# EasyEDA Pro project ProPrj_LED驱动_2025-10-14.epro

# Board PCB1
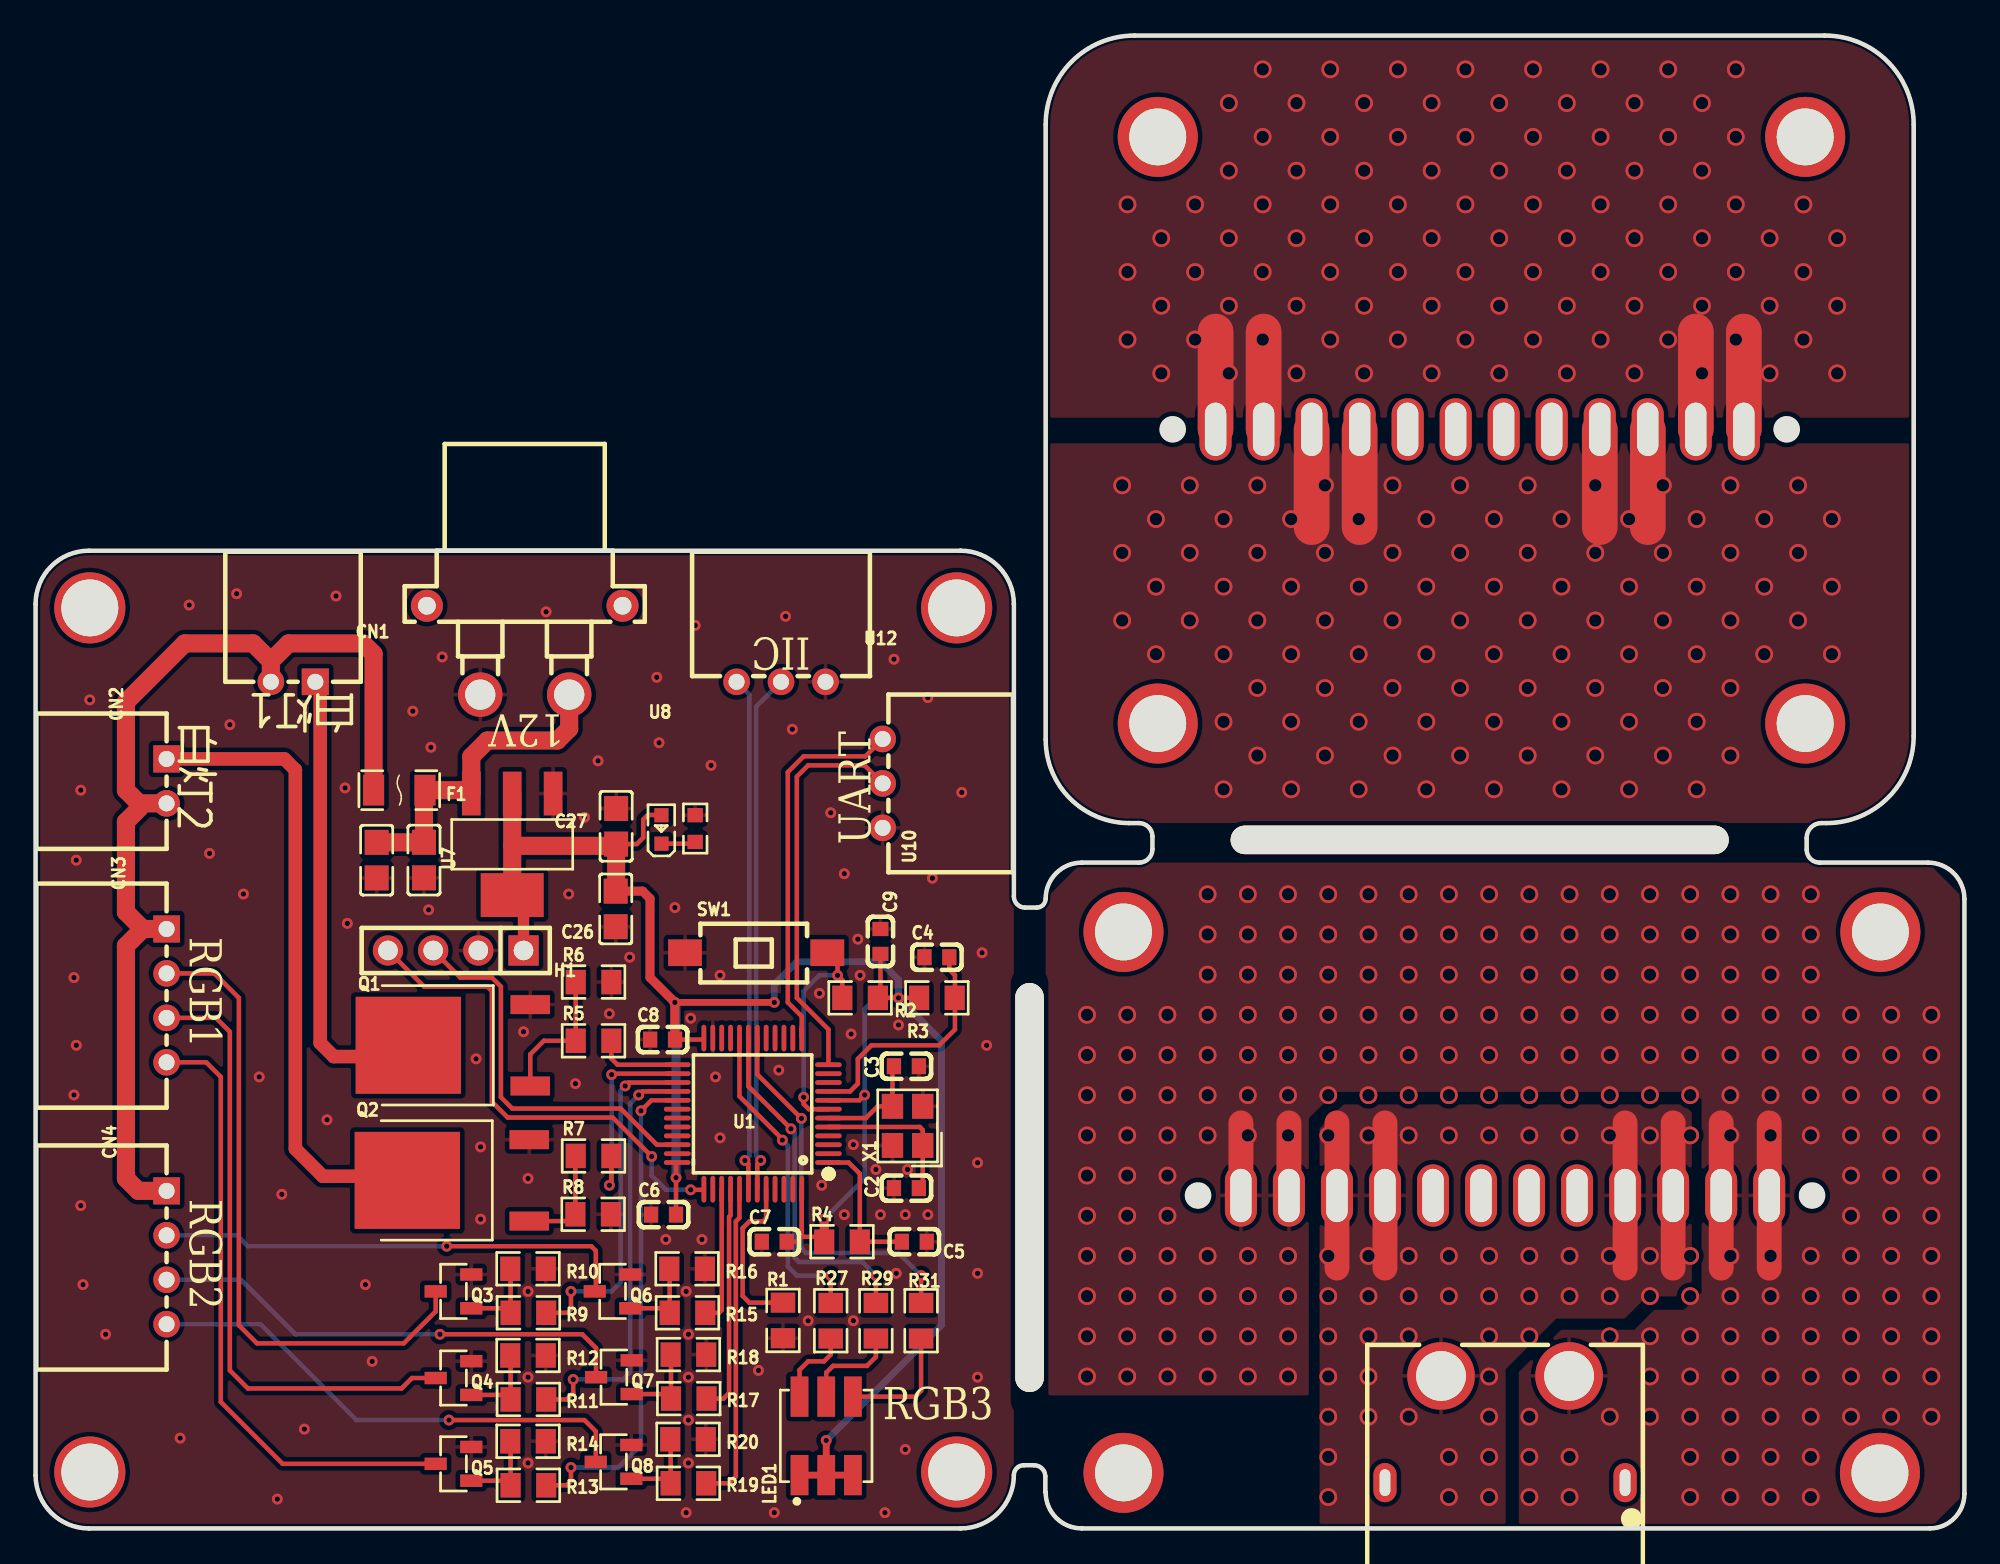
[diagram p0: board, top side]
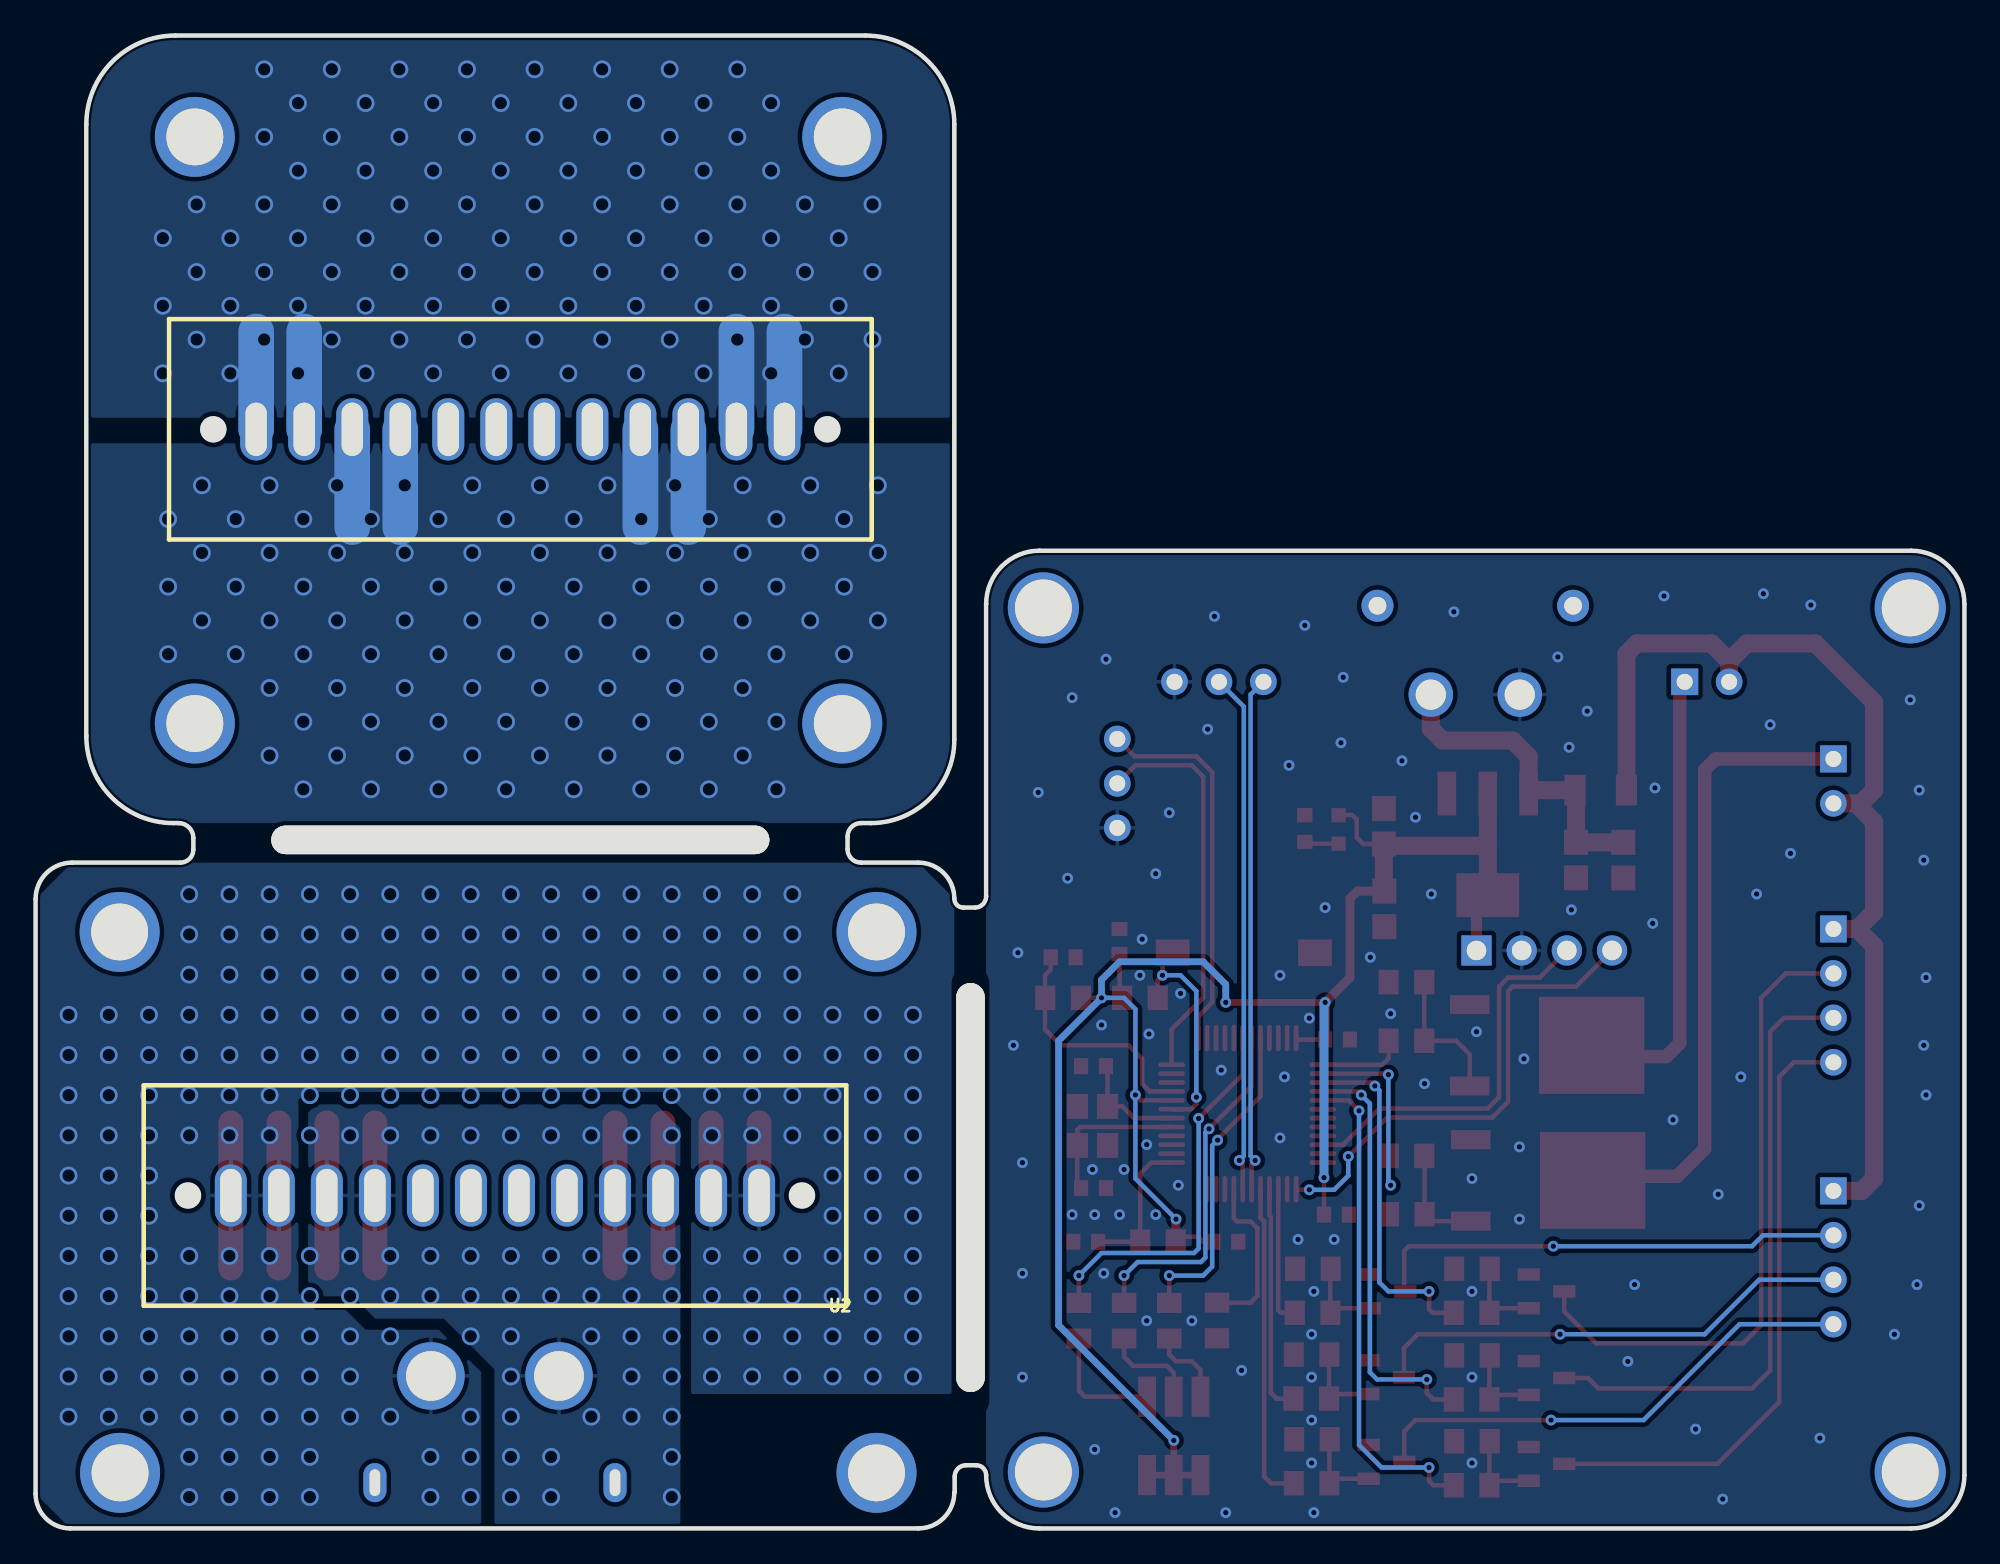
[diagram p1: board, bottom side, seen from below]

Outline 108.44 x 83.98 mm; copper layers: Top Layer, Bottom Layer. Coordinates in mm from the lower left corner of the outline.
Outline path: 0,52 arc(0.88,54.12) 3,55 52,55 arc(54.12,54.12) 55,52 55,35.55 arc(55.18,35.11) 55.63,34.92 56.28,34.92 arc(56.64,35.07) 56.79,35.43 arc(57.38,36.86) 58.81,37.45 62.04,37.45 arc(62.57,37.68) 62.79,38.21 62.79,38.92 arc(62.57,39.46) 62.03,39.68 61.49,39.68 arc(58.17,41.05) 56.79,44.38 56.79,78.98 arc(58.25,82.51) 61.79,83.98 100.59,83.98 arc(104.12,82.51) 105.59,78.98 105.59,44.58 arc(104.15,41.11) 100.69,39.68 100.41,39.68 arc(99.82,39.43) 99.57,38.84 99.57,38.18 arc(99.78,37.67) 100.3,37.45 106.39,37.45 arc(107.84,36.85) 108.44,35.4 108.44,1.95 arc(107.87,0.57) 106.49,0 58.81,0 arc(57.38,0.6) 56.79,2.03 arc(56.77,2.03) 56.77,2.05 56.77,2.92 arc(56.58,3.37) 56.13,3.56 55.56,3.56 arc(55.16,3.39) 55,3 arc(54.12,0.88) 52,0 3,0 arc(0.88,0.88) 0,3 0,52
Stack: Top Layer 0.035mm / Dielectric1 1.51mm FR4 er 4.5 / Bottom Layer 0.035mm

## Design rules (mm)
template: JLCPCB Capability(Two Layers Board)
spacing copperThickness1oz (default): track to track 0.102, other pairs 0.152 to 0.3
spacing copperThickness2oz: track to track 0.203, other pairs 0.152 to 0.3
track width copperThickness1oz (default): min 0.127, default 0.254, max 2.54
track width copperThickness2oz: min 0.203, default 0.254, max 2.54
differential pair differentialPair (default): width min 0.127, default 0.254, max 2.54; gap min 0.152, default 0.152
via viaSize (default): diameter min 0.5, default 0.61, max 10; hole min 0.3, default 0.305, max 6.3

## Placement (name value [footprint] x y rotation side)
C2  12pF  [C0603]  48.96 19.14 180 top
C3  12pF  [C0603]  48.96 26 180 top
C4  100nF  [C0603]  50.67 32.13 0 top
C5  100nF  [C0603]  49.4 16.13 180 top
C6  100nF  [C0603]  35.31 17.65 0 top
C7  100nF  [C0603]  41.53 16.13 0 top
C8  100nF  [C0603]  35.25 27.5 0 top
C9  100nF  [C0603]  47.5 33.02 270 top
C26  100nF  [C0805]  32.62 34.85 90 top
C27  100nF  [C0805]  32.64 39.5 270 top
C28  100nF  [C0805]  21.84 37.6 90 top
C29  100nF  [C0805]  19.18 37.59 90 top
CN1  ZX-XH2.54-2PWZ  [CONN-TH_2P-P2.50_ZX-XH2.54-2PWZ]  14.48 47.62 180 top
CN2  ZX-XH2.54-2PWZ  [CONN-TH_2P-P2.50_ZX-XH2.54-2PWZ]  7.37 42.04 270 top
CN3  ZX-XH2.54-4PWZ  [CONN-TH_4P-P2.50_ZX-XH2.54-4PWZ]  7.37 29.97 270 top
CN4  ZX-XH2.54-4PWZ  [CONN-TH_4P-P2.50_ZX-XH2.54-4PWZ]  7.37 15.24 270 top
F1  SMD1206-150-16  [F1206]  20.45 41.53 180 top
H1  -  [HDR-TH_4P-P2.54-V-F]  23.62 32.51 180 top
LED1  TC5050RGBF08-3CJH-AF53A  [LED-SMD_6P-L5.0-W5.0-TL_TC5050RGBF08]  44.45 5.21 90 top
LED7  -  [LED_0603]  35.18 39.37 90 top
NOREF  -  [Pad_e2494]  63.09 45.28 270 top
NOREF#2  -  [Pad_e105]  51.78 51.78 0 top
NOREF#3  -  [Pad_e2734]  61.16 33.55 180 top
NOREF#4  -  [Pad_e103]  3.05 3.18 0 top
NOREF#5  -  [Pad_e3136]  55.88 19.18 0 top
NOREF#6  -  [Pad_e2733]  61.16 3.13 180 top
NOREF#7  -  [Pad_e2731]  103.72 33.55 180 top
NOREF#8  -  [Pad_e101]  3.05 51.78 0 top
NOREF#9  -  [Pad_e3031]  81.19 38.73 270 top
NOREF#10  -  [Pad_e2497]  99.49 45.28 270 top
NOREF#11  -  [Pad_e2495]  63.09 78.28 270 top
NOREF#12  -  [Pad_e104]  51.78 3.18 0 top
NOREF#13  -  [Pad_e2732]  103.69 3.13 180 top
NOREF#14  -  [Pad_e2496]  99.49 78.28 270 top
Q1  MCU15N10A-TP  [DPAK-3_L6.6-W6.1-P2.28-LS9.9-BR]  24.38 27.18 0 top
Q2  MCU15N10A-TP  [DPAK-3_L6.6-W6.1-P2.28-LS9.9-BR]  24.33 19.58 0 top
Q3  5N10-MS  [SOT-23-3_L2.9-W1.3-P1.90-LS2.4-BL-1]  23.5 13.34 90 top
Q4  5N10-MS  [SOT-23-3_L2.9-W1.3-P1.90-LS2.4-BL-1]  23.5 8.46 90 top
Q5  5N10-MS  [SOT-23-3_L2.9-W1.3-P1.90-LS2.4-BL-1]  23.5 3.63 90 top
Q6  5N10-MS  [SOT-23-3_L2.9-W1.3-P1.90-LS2.4-BL-1]  32.44 13.34 90 top
Q7  5N10-MS  [SOT-23-3_L2.9-W1.3-P1.90-LS2.4-BL-1]  32.51 8.51 90 top
Q8  5N10-MS  [SOT-23-3_L2.9-W1.3-P1.90-LS2.4-BL-1]  32.49 3.74 90 top
R1  10K  [R0805]  42.02 11.7 90 top
R2  10K  [R0805]  46.35 29.84 180 top
R3  10K  [R0805]  50.67 29.84 0 top
R4  10K  [R0805]  45.34 16.13 0 top
R5  10K  [R0805]  31.37 27.43 0 top
R6  10K  [R0805]  31.37 30.73 0 top
R7  10K  [R0805]  31.37 20.96 0 top
R8  10K  [R0805]  31.35 17.67 0 top
R9  10K  [R0805]  27.71 12.13 0 top
R10  10K  [R0805]  27.69 14.6 0 top
R11  10K  [R0805]  27.71 7.26 0 top
R12  10K  [R0805]  27.69 9.73 0 top
R13  10K  [R0805]  27.71 2.43 0 top
R14  10K  [R0805]  27.69 4.9 0 top
R15  10K  [R0805]  36.65 12.13 0 top
R16  10K  [R0805]  36.63 14.6 0 top
R17  10K  [R0805]  36.72 7.3 0 top
R18  10K  [R0805]  36.7 9.78 0 top
R19  10K  [R0805]  36.7 2.54 0 top
R20  10K  [R0805]  36.68 5.01 0 top
R24  10K  [R0603]  37.08 39.37 270 top
R27  10K  [R0805]  44.7 11.68 90 top
R29  10K  [R0805]  47.24 11.68 90 top
R31  10K  [R0805]  49.78 11.68 90 top
SW1  TS-1101-C-W  [SW-SMD_L6.0-W3.3-LS8.0]  40.51 32.39 0 top
U1  -  [LQFP-48_L7.0-W7.0-P0.50-LS9.0-BL]  40.32 23.33 90 top
U1#2  -  [CONN-TH_12P-P2.70_JL-D50F-2.7PH-M]  81.19 61.83 0 bottom
U2  B31MF-12P-G  [CONN-TH_12P-P2.70_JL-D50F-2.7PH-M]  82.61 18.73 0 bottom
U3  XT60PW-F  [TH_2P-XT60PW-F]  82.61 5.58 180 top
U7  AMS1117-5.0  [SOT-223_L6.5-W3.5-P2.30-LS7.0-BR]  26.8 38.48 90 top
U8  XT30PW-F20.G.Y  [CONN-TH_XT30PW-F-1]  27.5 49.4 180 top
U10  ZX-XH2.54-3PWZ  [HDR-TH_3P-P2.50_ZX-XH2.54-3PWZ]  47.62 41.91 90 top
U12  ZX-XH2.54-3PWZ  [HDR-TH_3P-P2.50_ZX-XH2.54-3PWZ]  41.91 47.62 180 top
X1  32MHz  [CRYSTAL-SMD_4P-L3.2-W2.5-BL]  49.03 22.64 90 top

## Footprints (pads in the part's own frame, mm; a bottom-side part is the same pattern mirrored in y, then rotated)
C0603
  rect 0.8x0.9 smd: 1(-0.7,0) 2(0.7,0)
C0805
  rect 1.41x1.35 smd: 1(-1,0) 2(1,0)
CONN-TH_2P-P2.50_ZX-XH2.54-2PWZ
  rect 1.524x1.5 hole 0.9: 1(-1.25,0)
  round 1.5 hole 0.9: 2(1.25,0)
CONN-TH_4P-P2.50_ZX-XH2.54-4PWZ
  rect 1.524x1.5 hole 0.9: 1(-3.75,0)
  round 1.5 hole 0.9: 2(-1.25,0) 3(1.25,0) 4(3.75,0)
CONN-TH_12P-P2.70_JL-D50F-2.7PH-M
  oval 1.8x3.5 hole 1.2x3: 1(-14.85,0) 2(-12.15,0) 3(-9.45,0) 4(-6.75,0) 5(-4.05,0) 6(-1.35,0) 7(1.35,0) 8(4.05,0) 9(6.75,0) 10(9.45,0) 11(12.15,0) 12(14.85,0)
CONN-TH_XT30PW-F-1
  round 2.5 hole 1.7: 1(-2.5,2.5) 2(2.5,2.5)
  round 1.8 hole 1: 3(5.5,-2.5) 4(-5.5,-2.5)
CRYSTAL-SMD_4P-L3.2-W2.5-BL
  rect 1.4x1.2 smd: 1(-1.1,-0.85) 2(1.1,-0.85) 3(1.1,0.85) 4(-1.1,0.85)
DPAK-3_L6.6-W6.1-P2.28-LS9.9-BR
  rect 2.223x1.071 smd: 1(3.428,-2.29) 3(3.428,2.29)
  rect 5.925x5.46 smd: 2(-3.428,0)
F1206
  rect 1.19x1.728 smd: 1(-1.445,0) 2(1.445,0)
HDR-TH_3P-P2.50_ZX-XH2.54-3PWZ
  round 1.5 hole 0.9: 1(-2.5,0) 2(0,0) 3(2.5,0)
HDR-TH_4P-P2.54-V-F
  rect 1.7x1.7 hole 1.1: 1(-3.81,0)
  round 1.7 hole 1.1: 2(-1.27,0) 3(1.27,0) 4(3.81,0)
LED-SMD_6P-L5.0-W5.0-TL_TC5050RGBF08
  rect 2.265x1 smd: 1(-2.208,1.5) 2(-2.208,0) 3(-2.208,-1.5) 4(2.208,-1.5) 5(2.208,0) 6(2.208,1.5)
LED_0603
  rect 0.8x0.8 smd: 1(-0.851,-0.01) 2(0.75,-0.005)
LQFP-48_L7.0-W7.0-P0.50-LS9.0-BL
  oval 0.27x1.5 smd: 1(-2.75,-4.25) 2(-2.25,-4.25) 3(-1.75,-4.25) 4(-1.25,-4.25) 5(-0.75,-4.25) 6(-0.25,-4.25) 7(0.25,-4.25) 8(0.75,-4.25) 9(1.25,-4.25) 10(1.75,-4.25) 11(2.25,-4.25) 12(2.75,-4.25) 25(2.75,4.25) 26(2.25,4.25) 27(1.75,4.25) 28(1.25,4.25) 29(0.75,4.25) 30(0.25,4.25) 31(-0.25,4.25) 32(-0.75,4.25) 33(-1.25,4.25) 34(-1.75,4.25) 35(-2.25,4.25) 36(-2.75,4.25)
  oval 1.5x0.27 smd: 13(4.25,-2.75) 14(4.25,-2.25) 15(4.25,-1.75) 16(4.25,-1.25) 17(4.25,-0.75) 18(4.25,-0.25) 19(4.25,0.25) 20(4.25,0.75) 21(4.25,1.25) 22(4.25,1.75) 23(4.25,2.25) 24(4.25,2.75) 37(-4.25,2.75) 38(-4.25,2.25) 39(-4.25,1.75) 40(-4.25,1.25) 41(-4.25,0.75) 42(-4.25,0.25) 43(-4.25,-0.25) 44(-4.25,-0.75) 45(-4.25,-1.25) 46(-4.25,-1.75) 47(-4.25,-2.25) 48(-4.25,-2.75)
Pad_e101
  round 4 hole 3.2: 1(0,0)
Pad_e103
  round 4 hole 3.2: 1(0,0)
Pad_e104
  round 4 hole 3.2: 1(0,0)
Pad_e105
  round 4 hole 3.2: 1(0,0)
Pad_e2494
  round 4.5 hole 3.2: 1(0,0)
Pad_e2495
  round 4.5 hole 3.2: 1(0,0)
Pad_e2496
  round 4.5 hole 3.2: 1(0,0)
Pad_e2497
  round 4.5 hole 3.2: 1(0,0)
Pad_e2731
  round 4.5 hole 3.2: 1(0,0)
Pad_e2732
  round 4.5 hole 3.2: 1(0,0)
Pad_e2733
  round 4.5 hole 3.2: 1(0,0)
Pad_e2734
  round 4.5 hole 3.2: 1(0,0)
Pad_e3031
  oval 1.6x28 hole 1.6x28: 1(0,0)
Pad_e3136
  oval 1.6x23 hole 1.6x23: 1(0,0)
R0603
  rect 0.806x0.864 smd: 1(-0.753,0) 2(0.753,0)
R0805
  rect 1.133x1.377 smd: 1(-1,0) 2(1,0)
SOT-23-3_L2.9-W1.3-P1.90-LS2.4-BL-1
  rect 0.7x1.25 smd: 1(-0.95,-1) 2(0.95,-1) 3(0,1)
SOT-223_L6.5-W3.5-P2.30-LS7.0-BR
  rect 2.465x1.05 smd: 1(2.857,-2.3) 2(2.857,0) 3(2.857,2.3)
  rect 2.465x3.54 smd: 4(-2.857,0)
SW-SMD_L6.0-W3.3-LS8.0
  rect 1.9x1.5 smd: 1(-4,0) 2(4,0)
TH_2P-XT60PW-F
  oval 1.3x2.2 hole 0.6x1.5: 1(-6.75,3) 2(6.75,3)
  round 3.8 hole 2.8: 3(-3.6,-3) 4(3.6,-3)

## Nets
3V3: C6.2 C7.2 C8.2 C9.2 C26.2 C27.2 H1.1 LED1.1 LED1.2 LED1.3 LED7.2 R2.1 R3.1 R4.1 U1.8 U1.24 U1.36 U1.48 U7.2 U7.4
12V: CN1.2 CN2.2 CN3.1 CN4.1 F1.2
GND: C2.2 C3.1 C4.1 C5.1 C6.1 C7.1 C8.1 C9.1 C26.1 C27.1 C28.1 C29.1 H1.2 Q1.3 Q2.3 Q3.2 Q4.2 Q5.2 Q6.2 Q7.2 Q8.2 R1.1 R6.2 R8.2 R10.2 R12.2 R14.2 R16.2 R18.2 R20.2 R24.1 SW1.1 U1.23 U1.35 U1.47 U7.1 U8.2 U10.1 U12.1 X1.2 X1.4
VBAT: C5.2 R4.2 U1.1
VDDA: C4.2 R3.2 U1.9
VIN: C28.2 C29.2 F1.1 U7.3 U8.1
B: R27.2 U1.20
BLED1-: CN3.2 Q3.3
BLED2-: CN4.2 Q6.3
BOOT0: R1.2 U1.44
CAN_RX: U1.32
G: R29.2 U1.19
GLED1-: CN3.3 Q4.3
GLED2-: CN4.3 Q7.3
IIC_SCL: U1.42 U12.3
IIC_SDA: U1.43 U12.2
NRST: R2.2 SW1.2 U1.7
OIN: C2.1 U1.5 X1.1
OOUT: C3.2 U1.6 X1.3
P0: U2.5
P1: U2.6
P2: U2.7
P3: U2.8
PA8: R13.2 U1.29
PA13: U1.33
PACK+: U1#2.1 U1#2.2 U1#2.11 U1#2.12 U2.1 U2.2 U2.11 U2.12 U3.3
PACK-: U1#2.3 U1#2.4 U1#2.9 U1#2.10 U2.3 U2.4 U2.9 U2.10 U3.4
PB3: R15.2 U1.39
PB4: R17.2 U1.40
PB5: R19.2 U1.41
PB8: U1.45
PB9: U1.46
PB12: R5.2 U1.25
PB13: R7.2 U1.26
PB14: R9.2 U1.27
PB15: R11.2 U1.28
R: R31.2 U1.18
RLED1-: CN3.4 Q5.3
RLED2-: CN4.4 Q8.3
SPI_MISO: U1.16
SPI_MOSI: U1.17
SPI_SCK: U1.15
SWCLK: H1.4 U1.37
SWDIO: H1.3 U1.34
U1_RX: U1.31
U1_TX: U1.30
U2_RX: U1.13 U10.3
U2_TX: U1.12 U10.2
WAKE_UP: U1.10
WHITELED1-: CN1.1 Q1.2
WHITELED2-: CN2.1 Q2.2
$1N2514: Q1.1 R5.1 R6.1
$1N3021: Q2.1 R7.1 R8.1
$1N3392: Q3.1 R9.1 R10.1
$1N3821: Q4.1 R11.1 R12.1
$1N3962: Q5.1 R13.1 R14.1
$1N6050: Q7.1 R17.1 R18.1
$1N6062: Q6.1 R15.1 R16.1
$1N6070: Q8.1 R19.1 R20.1
$1N6515: LED1.5 R29.1
$1N6519: LED1.4 R31.1
$1N6525: LED1.6 R27.1
$2N597: LED7.1 R24.2

Pads without a net: NOREF 1; NOREF#2 1; NOREF#3 1; NOREF#4 1; NOREF#5 1; NOREF#6 1; NOREF#7 1; NOREF#8 1; NOREF#9 1; NOREF#10 1; NOREF#11 1; NOREF#12 1; NOREF#13 1; NOREF#14 1; U1 2 3 4 11 14 21 22 38; U1#2 5 6 7 8; U3 1 2; U8 3 4

## Via types
v1: diameter 0.61, hole 0.305, Top Layer to Bottom Layer, 125 vias
v2: diameter 1, hole 0.7, Top Layer to Bottom Layer, 457 vias

## Routing (per net, layer and track width the routed paths; a pad name or vN(x,y) marks a point on that pad's centre or on a via; arc(x,y) is an arc through that point)
3V3: length 123.9
  Top Layer w0.254: v1(46.61,24.38) 46.31,24.08 U1.8 ; C7.2 42.8,16.13 43.07,16.4 ; C9.2 47.5,29.99 R2.1 v1(48.51,29.84) R3.1 ; R4.1 44.06,16.4 43.07,16.4 ; C6.2 v1(36.01,19.73) 36.01,20.52 U1.36 ; 43.07,16.4 U1.48 ; U1.24 37.49,27.5 C8.2 ; LED7.2 35.17,40.13 34.42,40.13 34.16,39.88 34.16,38.86 33.8,38.5 C27.2
  Top Layer w0.381: v1(35.94,29.59) v1(41.53,29.59) ; LED1.2 LED1.3 ; LED1.2 LED1.1 ; LED1.2 v1(44.45,4.95)
  Top Layer w0.508: C8.2 35.94,27.51 v1(35.94,29.59) 34.54,30.99 34.54,35.43 34.13,35.85 C26.2 ; R4.1 44.34,17.38 v1(44.32,17.4)
  Top Layer w0.635: H1.1 27.43,34.99 U7.4
  Top Layer w1.016: U7.2 26.8,38.4 ; 26.8,38.4 32.54,38.4 C27.2 32.64,35.87 C26.2 ; 26.8,38.4 U7.4
  Bottom Layer w0.254: v1(44.32,17.4) 46.61,19.69 v1(46.61,24.38) 46.61,29.21 47.24,29.84 v1(48.51,29.84)
  Bottom Layer w0.381: v1(41.53,29.59) 41.53,30.61 42.8,31.88 47.5,31.88 48.51,30.86 v1(48.51,29.84) 50.93,27.43 50.93,11.43 v1(44.45,4.95)
  Bottom Layer w0.508: v1(36.01,19.73) 36.01,29.53 v1(35.94,29.59)
12V: length 58.6
  Top Layer w1.016: CN2.2 5.82,40.79 5.08,41.53 5.08,46.48 8.38,49.78 12.23,49.78 13.23,48.79 ; 5.84,40.51 5.08,39.75 5.08,34.67 6.03,33.72 ; 13.23,48.79 14.22,49.78 18.42,49.78 19,49.2 F1.2 ; 13.23,48.79 CN1.2 ; 6.03,33.72 5.08,32.77 5.08,19.69 5.78,18.99 CN4.1 ; 6.03,33.72 CN3.1
GND:
  vias: v1(2.16,30.99) v1(2.16,24.38) v1(2.29,37.59) v1(2.29,27.18) v1(2.54,41.53) v1(2.54,18.16) v1(2.67,13.72) v1(3.05,46.61) v1(3.94,10.92) v1(8.13,5.08) v1(8.64,51.94) v1(9.78,37.97) v1(10.92,45.21) v1(11.3,52.58) v1(11.68,35.69) v1(12.57,25.4) v1(13.59,1.65) v1(13.84,18.8) v1(15.11,5.59) v1(16.38,22.99) v1(16.89,52.45) v1(17.4,41.66) v1(17.53,34.04) v1(18.54,13.72) v1(18.92,9.4) v1(21.21,45.97) v1(22.1,34.8) v1(22.22,43.94) v1(22.86,49.02) v1(24.77,26.42) v1(25.02,21.46) v1(25.02,17.4) v1(27.43,27.94) v1(27.69,19.69) v1(27.69,13.34) v1(27.69,8.51) v1(27.69,3.68) v1(28.7,51.56) v1(29.97,35.69) v1(30.35,25.02) v1(30.86,40) v1(31.62,43.18) v1(32.26,28.96) v1(33.4,32.13) v1(34.92,47.88) v1(35.05,44.2) v1(35.43,16.26) v1(35.94,34.92) v1(36.58,13.34) v1(36.58,0.89) v1(36.7,10.92) v1(36.7,8.51) v1(36.7,6.1) v1(36.7,3.68) v1(36.83,28.7) v1(37.08,50.8) v1(37.47,16.26) v1(37.97,42.93) v1(38.23,25.4) v1(38.48,31.11) v1(38.48,21.97) v1(40.64,8.89) v1(41.53,0.89) v1(41.78,25.78) v1(42.16,51.31) v1(42.54,44.96) v1(43.43,11.68) v1(44.07,30.1) v1(44.2,19.3) v1(44.7,40.26) v1(45.47,36.83) v1(45.47,17.65) v1(45.85,27.81) v1(45.97,21.59) v1(45.97,11.68) v1(46.23,33.15) v1(46.35,31.11) v1(47.24,20.19) v1(47.5,17.65) v1(47.75,0.89) v1(48.26,48.89) v1(48.39,14.35) v1(48.51,28.32) v1(48.9,17.65) v1(48.9,4.44) v1(49.02,20.19) v1(50.16,46.74) v1(50.16,17.65) v1(50.42,36.58) v1(52.07,41.4) v1(52.96,20.57) v1(52.96,14.35) v1(52.96,8.51) v1(53.21,32.39) v1(53.47,27.18)
VBAT: length 8.2
  Top Layer w0.254: C5.2 R4.2 46.34,19.96 45.71,20.58 U1.1
VDDA: length 13.6
  Top Layer w0.254: C4.2 51.37,31.43 51.69,31.11 51.69,29.86 R3.2 51.69,29.83 51.69,28.07 50.8,27.18 46.99,27.18 46.23,26.42 46.23,25.02 45.79,24.58 U1.9
VIN: length 18.1
  Top Layer w1.016: 21.97,41.15 21.84,41.01 C28.2 21.83,38.59 C29.2 ; F1.1 24.31,41.53 U7.3 24.5,43.42 25.4,44.32 29.34,44.32 30,44.99 U8.1
B: length 18.1
  Top Layer w0.254: v1(41.99,21.84) 41.99,21.9 39.57,24.31 U1.20 ; v1(44.7,14.22) R27.2
  Bottom Layer w0.254: v1(41.99,21.84) 42.29,21.54 42.29,14.73 42.8,14.22 v1(44.7,14.22)
BLED1-: length 36.4
  Top Layer w0.254: Q3.3 22.5,12.21 20.7,10.41 12.45,10.41 11.43,11.43 11.43,29.84 10.05,31.22 CN3.2
BLED2-: length 26.8
  Top Layer w0.254: v1(23.11,15.88) 31.24,15.88 31.5,15.62 31.5,13.39 Q6.3
  Bottom Layer w0.254: CN4.2 11.32,16.49 11.94,15.88 v1(23.11,15.88)
BOOT0: length 9.4
  Top Layer w0.254: R1.2 40.13,12.7 39.75,13.08 39.75,16.89 40.13,17.27 40.89,17.27 41.07,17.45 U1.44
G: length 20
  Top Layer w0.254: v1(47.24,14.22) R29.2 ; U1.19 40.07,24.87 v1(42.47,22.48)
  Bottom Layer w0.254: v1(47.24,14.22) 46.48,14.99 42.93,14.99 42.67,15.24 42.67,22.28 v1(42.47,22.48)
GLED1-: length 35.2
  Top Layer w0.254: Q4.3 21.16,8.46 20.57,7.87 11.94,7.87 10.92,8.89 10.92,27.94 10.14,28.72 CN3.3
GLED2-: length 27.4
  Top Layer w0.254: v1(22.73,10.92) 30.73,10.92 31.51,10.14 Q7.3
  Bottom Layer w0.254: v1(22.73,10.92) 14.61,10.92 11.54,13.99 CN4.3
IIC_SCL: length 29
  Top Layer w0.254: v1(39.88,20.7) 40.07,20.51 U1.42
  Bottom Layer w0.254: v1(39.88,20.7) 40.13,20.96 40.13,46.9 U12.3
IIC_SDA: length 29.3
  Top Layer w0.254: U1.43 40.57,20.51 v1(40.77,20.7)
  Bottom Layer w0.254: U12.2 40.51,46.23 40.51,20.96 v1(40.77,20.7)
NRST: length 13
  Top Layer w0.254: SW1.2 45.09,31.81 v1(45.09,31.11) 45.35,30.84 R2.2 ; v1(43.18,24.26) 43.18,23.88 43.47,23.58 U1.7
  Bottom Layer w0.254: v1(43.18,24.26) 43.18,30.23 44.07,31.11 v1(45.09,31.11)
OIN: length 8.7
  Top Layer w0.254: C2.1 49.88,19.36 X1.1 49.88,22.42 49.71,22.58 U1.5
OOUT: length 6.2
  Top Layer w0.254: C3.2 48.18,25.92 X1.3 47.34,23.74 46.68,23.08 U1.6
PA8: length 27.8
  Top Layer w0.254: v1(30.1,3.43) 30.1,2.67 29.86,2.43 R13.2 ; U1.29 34.62,24.08 v1(34.04,23.5)
  Bottom Layer w0.254: v1(30.1,3.43) 32.77,3.43 34.04,4.7 v1(34.04,23.5)
PACK+: length 68.5
  Top Layer w1.397: 94.76,22.81 U2.11 94.76,14.64 ; 97.46,22.81 U2.12 97.46,14.64 ; U2.2 70.47,22.81 ; U2.1 67.76,22.81
  Top Layer w2: U1#2.1 66.34,67.33 ; U1#2.2 69.04,67.33 ; U1#2.12 96.04,67.33 ; U1#2.11 93.34,67.33
  Bottom Layer w2: U1#2.2 69.04,67.33 ; U1#2.11 93.34,67.33 ; U1#2.1 66.34,67.33 ; U1#2.12 96.04,67.33
  vias: v2(59.11,28.89) v2(59.11,26.63) v2(59.11,24.37) v2(59.11,22.11) v2(59.11,19.85) v2(59.11,17.59) v2(59.11,15.33) v2(59.11,13.07) v2(59.11,10.81) v2(59.11,8.55) v2(61.39,74.48) v2(61.39,70.68) v2(61.39,66.88) v2(61.37,28.89) v2(61.37,26.63) v2(61.37,24.37) v2(61.37,22.11) v2(61.37,19.85) v2(61.37,17.59) v2(61.37,15.33) v2(61.37,13.07) v2(61.37,10.81) v2(61.37,8.55) v2(63.29,72.58) v2(63.29,68.78) v2(63.29,64.98) v2(63.63,28.89) v2(63.63,26.63) v2(63.63,24.37) v2(63.63,22.11) v2(63.63,19.85) v2(63.63,17.59) v2(63.63,15.33) v2(63.63,13.07) v2(63.63,10.81) v2(63.63,8.55) v2(65.19,74.48) v2(65.19,70.68) v2(65.19,66.88) v2(65.89,35.67) v2(65.89,33.41) v2(65.89,31.15) v2(65.89,28.89) v2(65.89,26.63) v2(65.89,24.37) v2(65.89,22.11) v2(65.89,15.33) v2(65.89,13.07) v2(65.89,10.81) v2(65.89,8.55) v2(67.09,80.18) v2(67.09,76.38) v2(67.09,72.58) v2(67.09,68.78) v2(67.09,64.98) v2(68.16,35.67) v2(68.16,33.41) v2(68.16,31.15) v2(68.16,28.89) v2(68.16,26.63) v2(68.16,24.37) v2(68.16,22.11) v2(68.16,15.33) v2(68.16,13.07) v2(68.16,10.81) v2(68.16,8.55) v2(68.99,82.08) v2(68.99,78.28) v2(68.99,74.48) v2(68.99,70.68) v2(68.99,66.88) v2(70.42,35.67) v2(70.42,33.41) v2(70.42,31.15) v2(70.42,28.89) v2(70.42,26.63) v2(70.42,24.37) v2(70.42,22.11) v2(70.42,15.33) v2(70.42,13.07) v2(70.42,10.81) v2(70.42,8.55) v2(70.89,80.18) v2(70.89,76.38) v2(70.89,72.58) v2(70.89,68.78) v2(70.89,64.98) v2(72.68,35.67) v2(72.68,33.41) v2(72.68,31.15) v2(72.68,28.89) v2(72.68,26.63) v2(72.68,24.37) v2(72.79,82.08) v2(72.79,78.28) v2(72.79,74.48) v2(72.79,70.68) v2(72.79,66.88) v2(74.69,80.18) v2(74.69,76.38) v2(74.69,72.58) v2(74.69,68.78) v2(74.69,64.98) v2(74.94,35.67) v2(74.94,33.41) v2(74.94,31.15) v2(74.94,28.89) v2(74.94,26.63) v2(74.94,24.37) v2(76.59,82.08) v2(76.59,78.28) v2(76.59,74.48) v2(76.59,70.68) v2(76.59,66.88) v2(77.2,35.67) v2(77.2,33.41) v2(77.2,31.15) v2(77.2,28.89) v2(77.2,26.63) v2(77.2,24.37) v2(78.49,80.18) v2(78.49,76.38) v2(78.49,72.58) v2(78.49,68.78) v2(78.49,64.98) v2(79.46,35.67) v2(79.46,33.41) v2(79.46,31.15) v2(79.46,28.89) v2(79.46,26.63) v2(79.46,24.37) v2(80.39,82.08) v2(80.39,78.28) v2(80.39,74.48) v2(80.39,70.68) v2(80.39,66.88) v2(81.72,35.67) v2(81.72,33.41) v2(81.72,31.15) v2(81.72,28.89) v2(81.72,26.63) v2(81.72,24.37) v2(82.29,80.18) v2(82.29,76.38) v2(82.29,72.58) v2(82.29,68.78) v2(82.29,64.98) v2(83.98,35.67) v2(83.98,33.41) v2(83.98,31.15) v2(83.98,28.89) v2(83.98,26.63) v2(83.98,24.37) v2(83.98,6.29) v2(83.98,4.03) v2(83.98,1.77) v2(84.19,82.08) v2(84.19,78.28) v2(84.19,74.48) v2(84.19,70.68) v2(84.19,66.88) v2(86.09,80.18) v2(86.09,76.38) v2(86.09,72.58) v2(86.09,68.78) v2(86.09,64.98) v2(86.24,35.67) v2(86.24,33.41) v2(86.24,31.15) v2(86.24,28.89) v2(86.24,26.63) v2(86.24,24.37) v2(86.24,4.03) v2(86.24,1.77) v2(87.99,82.08) v2(87.99,78.28) v2(87.99,74.48) v2(87.99,70.68) v2(87.99,66.88) v2(88.5,35.67) v2(88.5,33.41) v2(88.5,31.15) v2(88.5,28.89) v2(88.5,26.63) v2(88.5,24.37) v2(88.5,10.81) v2(88.5,6.29) v2(89.89,80.18) v2(89.89,76.38) v2(89.89,72.58) v2(89.89,68.78) v2(89.89,64.98) v2(90.76,35.67) v2(90.76,33.41) v2(90.76,31.15) v2(90.76,28.89) v2(90.76,26.63) v2(90.76,24.37) v2(90.76,10.81) v2(90.76,8.55) v2(90.76,6.29) v2(91.79,82.08) v2(91.79,78.28) v2(91.79,74.48) v2(91.79,70.68) v2(91.79,66.88) v2(93.02,35.67) v2(93.02,33.41) v2(93.02,31.15) v2(93.02,28.89) v2(93.02,26.63) v2(93.02,24.37) v2(93.02,13.07) v2(93.02,10.81) v2(93.02,8.55) v2(93.02,6.29) v2(93.02,4.03) v2(93.02,1.77) v2(93.69,80.18) v2(93.69,76.38) v2(93.69,72.58) v2(93.69,68.78) v2(93.69,64.98) v2(95.28,35.67) v2(95.28,33.41) v2(95.28,31.15) v2(95.28,28.89) v2(95.28,26.63) v2(95.28,24.37) v2(95.28,22.11) v2(95.28,15.33) v2(95.28,13.07) v2(95.28,10.81) v2(95.28,8.55) v2(95.28,6.29) v2(95.28,4.03) v2(95.28,1.77) v2(95.59,82.08) v2(95.59,78.28) v2(95.59,74.48) v2(95.59,70.68) v2(95.59,66.88) v2(97.49,72.58) v2(97.49,68.78) v2(97.49,64.98) v2(97.54,35.67) v2(97.54,33.41) v2(97.54,31.15) v2(97.54,28.89) v2(97.54,26.63) v2(97.54,24.37) v2(97.54,22.11) v2(97.54,15.33) v2(97.54,13.07) v2(97.54,10.81) v2(97.54,8.55) v2(97.54,6.29) v2(97.54,4.03) v2(97.54,1.77) v2(99.39,74.48) v2(99.39,70.68) v2(99.39,66.88) v2(99.8,35.67) v2(99.8,33.41) v2(99.8,31.15) v2(99.8,28.89) v2(99.8,26.63) v2(99.8,24.37) v2(99.8,22.11) v2(99.8,15.33) v2(99.8,13.07) v2(99.8,10.81) v2(99.8,8.55) v2(99.8,6.29) v2(99.8,4.03) v2(99.8,1.77) v2(101.29,72.58) v2(101.29,68.78) v2(101.29,64.98) v2(102.06,28.89) v2(102.06,26.63) v2(102.06,24.37) v2(102.06,22.11) v2(102.06,19.85) v2(102.06,17.59) v2(102.06,15.33) v2(102.06,13.07) v2(102.06,10.81) v2(102.06,8.55) v2(102.06,6.29) v2(104.32,28.89) v2(104.32,26.63) v2(104.32,24.37) v2(104.32,22.11) v2(104.32,19.85) v2(104.32,17.59) v2(104.32,15.33) v2(104.32,13.07) v2(104.32,10.81) v2(104.32,8.55) v2(104.32,6.29) v2(106.59,28.89) v2(106.59,26.63) v2(106.59,24.37) v2(106.59,22.11) v2(106.59,19.85) v2(106.59,17.59) v2(106.59,15.33) v2(106.59,13.07) v2(106.59,10.81) v2(106.59,8.55) v2(106.59,6.29)
PACK-: length 76.7
  Top Layer w1.397: 89.36,14.64 U2.9 89.36,22.81 ; 73.16,14.64 U2.3 73.16,22.81 ; 92.06,22.81 U2.10 92.06,14.64 ; 75.86,14.64 U2.4 75.86,22.81
  Top Layer w2: U1#2.9 87.94,56.33 ; U1#2.3 71.74,56.33 ; U1#2.10 90.64,56.33 ; U1#2.4 74.44,56.33
  Bottom Layer w2: U1#2.4 74.44,56.33 ; U1#2.3 71.74,56.33 ; U1#2.10 90.64,56.33 ; U1#2.9 87.94,56.33
  vias: v2(61.09,58.68) v2(61.09,54.88) v2(61.09,51.08) v2(62.99,56.78) v2(62.99,52.98) v2(62.99,49.18) v2(64.89,58.68) v2(64.89,54.88) v2(64.89,51.08) v2(66.79,56.78) v2(66.79,52.98) v2(66.79,49.18) v2(66.79,45.38) v2(66.79,41.58) v2(68.69,58.68) v2(68.69,54.88) v2(68.69,51.08) v2(68.69,47.28) v2(68.69,43.48) v2(70.59,56.78) v2(70.59,52.98) v2(70.59,49.18) v2(70.59,45.38) v2(70.59,41.58) v2(72.49,58.68) v2(72.49,54.88) v2(72.49,51.08) v2(72.49,47.28) v2(72.49,43.48) v2(72.68,22.11) v2(72.68,15.33) v2(72.68,13.07) v2(72.68,10.81) v2(72.68,8.55) v2(72.68,6.29) v2(72.68,4.03) v2(72.68,1.77) v2(74.39,56.78) v2(74.39,52.98) v2(74.39,49.18) v2(74.39,45.38) v2(74.39,41.58) v2(74.94,22.11) v2(74.94,15.33) v2(74.94,13.07) v2(74.94,10.81) v2(74.94,8.55) v2(74.94,6.29) v2(76.29,58.68) v2(76.29,54.88) v2(76.29,51.08) v2(76.29,47.28) v2(76.29,43.48) v2(77.2,22.11) v2(77.2,15.33) v2(77.2,13.07) v2(77.2,10.81) v2(77.2,6.29) v2(78.19,56.78) v2(78.19,52.98) v2(78.19,49.18) v2(78.19,45.38) v2(78.19,41.58) v2(79.46,22.11) v2(79.46,15.33) v2(79.46,13.07) v2(79.46,4.03) v2(79.46,1.77) v2(80.09,58.68) v2(80.09,54.88) v2(80.09,51.08) v2(80.09,47.28) v2(80.09,43.48) v2(81.72,22.11) v2(81.72,15.33) v2(81.72,13.07) v2(81.72,10.81) v2(81.72,8.55) v2(81.72,6.29) v2(81.72,4.03) v2(81.72,1.77) v2(81.99,56.78) v2(81.99,52.98) v2(81.99,49.18) v2(81.99,45.38) v2(81.99,41.58) v2(83.89,58.68) v2(83.89,54.88) v2(83.89,51.08) v2(83.89,47.28) v2(83.89,43.48) v2(83.98,22.11) v2(83.98,15.33) v2(83.98,13.07) v2(83.98,10.81) v2(85.79,56.78) v2(85.79,52.98) v2(85.79,49.18) v2(85.79,45.38) v2(85.79,41.58) v2(86.24,22.11) v2(86.24,15.33) v2(86.24,13.07) v2(87.69,58.68) v2(87.69,54.88) v2(87.69,51.08) v2(87.69,47.28) v2(87.69,43.48) v2(88.5,22.11) v2(88.5,15.33) v2(88.5,13.07) v2(89.59,56.78) v2(89.59,52.98) v2(89.59,49.18) v2(89.59,45.38) v2(89.59,41.58) v2(90.76,22.11) v2(90.76,15.33) v2(90.76,13.07) v2(91.49,58.68) v2(91.49,54.88) v2(91.49,51.08) v2(91.49,47.28) v2(91.49,43.48) v2(93.02,22.11) v2(93.02,15.33) v2(93.39,56.78) v2(93.39,52.98) v2(93.39,49.18) v2(93.39,45.38) v2(93.39,41.58) v2(95.29,58.68) v2(95.29,54.88) v2(95.29,51.08) v2(95.29,47.28) v2(95.29,43.48) v2(97.19,56.78) v2(97.19,52.98) v2(97.19,49.18) v2(99.09,58.68) v2(99.09,54.88) v2(99.09,51.08) v2(100.99,56.78) v2(100.99,52.98) v2(100.99,49.18)
PB3: length 7.8
  Top Layer w0.254: R15.2 38.42,12.13 38.57,12.28 U1.39
PB4: length 12.9
  Top Layer w0.254: U1.40 39.07,17.61 38.99,17.53 38.99,7.62 38.67,7.3 R17.2
PB5: length 18.1
  Top Layer w0.254: R19.2 38.99,2.54 39.37,2.92 39.37,17.27 39.57,17.48 U1.41
PB12: length 4.8
  Top Layer w0.254: R5.2 32.37,26.43 32.72,26.08 U1.25
PB13: length 11.7
  Top Layer w0.254: U1.26 32.44,25.58 v1(32.39,25.53) ; R7.2 32.37,19.41 v1(32.26,19.3)
  Bottom Layer w0.254: v1(32.39,25.53) 32.39,19.43 v1(32.26,19.3)
PB14: length 19.7
  Top Layer w0.254: R9.2 29.91,12.13 30.1,12.32 v1(30.1,13.34) ; v1(33.15,24.89) 33.34,25.08 U1.27
  Bottom Layer w0.254: v1(33.15,24.89) 32.89,24.64 32.89,13.84 32.39,13.34 v1(30.1,13.34)
PB15: length 23.8
  Top Layer w0.254: v1(33.91,24.38) 34.11,24.58 U1.28 ; v1(30.23,8.38) 30.23,7.62 29.86,7.26 R11.2
  Bottom Layer w0.254: v1(33.91,24.38) 33.43,23.9 33.43,8.79 33.02,8.38 v1(30.23,8.38)
R: length 21.8
  Top Layer w0.254: v1(43.05,23.06) 40.57,25.54 U1.18 ; v1(49.78,14.22) R31.2
  Bottom Layer w0.254: v1(49.78,14.22) 48.51,15.49 43.31,15.49 43.05,15.75 v1(43.05,23.06)
RLED1-: length 35.2
  Top Layer w0.254: Q5.3 13.89,3.63 10.41,7.11 10.41,25.4 9.59,26.22 CN3.4
RLED2-: length 28.3
  Top Layer w0.254: Q8.3 31.5,3.75 31.5,5.46 30.86,6.1 v1(23.24,6.1)
  Bottom Layer w0.254: v1(23.24,6.1) 18.03,6.1 12.64,11.49 CN4.4
SWCLK: length 27.6
  Top Layer w0.254: U1.37 37.54,19.05 v1(36.83,19.05) ; H1.4 21.84,30.48 25.4,30.48 25.65,30.23 25.65,24 26.54,23.11 32.45,23.11 v1(34.64,20.92)
  Bottom Layer w0.254: v1(34.64,20.92) 34.64,19.84 35.43,19.05 v1(36.83,19.05)
SWDIO: length 21.9
  Top Layer w0.254: U1.34 34.93,21.58 32.89,23.62 26.8,23.62 26.16,24.26 26.16,30.48 25.65,30.99 23.88,30.99 H1.3
U2_RX: length 21.4
  Top Layer w0.254: U1.13 43.07,28.81 42.29,29.59 42.29,42.55 43.18,43.43 46.65,43.43 U10.3
U2_TX: length 22.5
  Top Layer w0.254: U1.12 44.57,28.07 42.8,29.84 42.8,42.29 43.43,42.93 46.61,42.93 U10.2
WHITELED1-: length 26
  Top Layer w0.762: CN1.1 16,47.35 16,27.31 16.76,26.54 20.32,26.54 Q1.2
WHITELED2-: length 36.1
  Top Layer w0.762: 20.96,20.45 20.32,19.81 16.15,19.81 14.61,21.36 14.61,42.67 13.99,43.29 CN2.1
$1N2514: length 8
  Top Layer w0.254: Q1.1 27.81,26.67 28.58,27.43 R5.1 R6.1
$1N3021: length 6
  Top Layer w0.254: R7.1 30.35,20.94 R8.1 29.96,17.29 Q2.1
$1N3392: length 4.8
  Top Layer w0.254: R10.1 26.71,14.59 R9.1 26.45,12.38 24.5,12.38
$1N3821: length 4.8
  Top Layer w0.254: Q4.1 26.45,7.51 R11.1 26.71,9.71 R12.1
$1N3962: length 4.8
  Top Layer w0.254: Q5.1 26.45,2.68 R13.1 26.71,4.88 R14.1
$1N6050: length 4.8
  Top Layer w0.254: R18.1 35.72,9.76 R17.1 35.47,7.56 Q7.1
$1N6062: length 4.8
  Top Layer w0.254: R16.1 35.65,14.59 R15.1 35.39,12.38 33.44,12.38
$1N6070: length 4.8
  Top Layer w0.254: Q8.1 35.45,2.79 R19.1 35.7,4.99 R20.1
$1N6515: length 5.5
  Top Layer w0.254: R29.1 47.24,9.65 46.74,9.14 44.83,9.14 44.45,8.76 LED1.5
$1N6519: length 6.9
  Top Layer w0.254: LED1.4 49.45,7.41 49.78,7.75 R31.1
$1N6525: length 4.5
  Top Layer w0.254: R27.1 44.7,9.78 44.32,9.4 43.43,9.4 42.95,8.91 LED1.6
$2N597: length 1.9
  Top Layer w0.254: LED7.1 36.99,38.52 R24.2

## Copper pours and planes (outline as drawn; the poured copper is in the pictures)
GND on Top Layer: 0,52 0.01,52.26 0.06,52.61 0.15,52.94 0.28,53.27 0.45,53.57 0.65,53.86 0.88,54.12 1.14,54.35 1.43,54.55 1.73,54.72 2.06,54.85 2.39,54.94 2.74,54.99 3,55 52,55 52.26,54.99 52.61,54.94 52.94,54.85 53.27,54.72 53.57,54.55 53.86,54.35 54.12,54.12 54.35,53.86 54.55,53.57 54.72,53.27 54.85,52.94 54.94,52.61 54.99,52.26 55,52 55,3 54.99,2.74 54.94,2.39 54.85,2.06 54.72,1.73 54.55,1.43 54.35,1.14 54.12,0.88 53.86,0.65 53.57,0.45 53.27,0.28 52.94,0.15 52.61,0.06 52.26,0.01 52,0 3,0 2.74,0.01 2.39,0.06 2.06,0.15 1.73,0.28 1.43,0.45 1.14,0.65 0.88,0.88 0.65,1.14 0.45,1.43 0.28,1.73 0.15,2.06 0.06,2.39 0.01,2.74 0,3
GND on Bottom Layer: 0,52 0.01,52.26 0.06,52.61 0.15,52.94 0.28,53.27 0.45,53.57 0.65,53.86 0.88,54.12 1.14,54.35 1.43,54.55 1.73,54.72 2.06,54.85 2.39,54.94 2.74,54.99 3,55 52,55 52.26,54.99 52.61,54.94 52.94,54.85 53.27,54.72 53.57,54.55 53.86,54.35 54.12,54.12 54.35,53.86 54.55,53.57 54.72,53.27 54.85,52.94 54.94,52.61 54.99,52.26 55,52 55,3 54.99,2.74 54.94,2.39 54.85,2.06 54.72,1.73 54.55,1.43 54.35,1.14 54.12,0.88 53.86,0.65 53.57,0.45 53.27,0.28 52.94,0.15 52.61,0.06 52.26,0.01 52,0 3,0 2.74,0.01 2.39,0.06 2.06,0.15 1.73,0.28 1.43,0.45 1.14,0.65 0.88,0.88 0.65,1.14 0.45,1.43 0.28,1.73 0.15,2.06 0.06,2.39 0.01,2.74 0,3
PACK+ on Top Layer: 71.59,7.49 56.79,7.49 56.79,35.43 58.81,37.45 106.39,37.45 108.44,35.4 108.44,1.95 106.49,0 83.39,0 83.39,8.8 85.76,11.18 89.89,11.18 91.01,12.3 92.69,12.3 93.66,13.28 93.66,24.13 93.24,24.55 73.06,24.55 71.59,23.08
PACK+ on Top Layer: 76.19,83.58 86.19,83.58 86.19,78.58 76.19,78.58
PACK+ on Bottom Layer: 76.19,83.58 86.19,83.58 86.19,78.58 76.19,78.58
PACK+ on Bottom Layer: 71.59,7.56 56.79,7.56 56.79,35.43 58.81,37.45 106.39,37.45 108.44,35.4 108.44,1.95 106.49,0 83.39,0 83.39,8.8 85.76,11.18 89.89,11.18 91.01,12.3 92.69,12.3 93.66,13.28 93.66,24.13 93.24,24.55 73.06,24.55 71.59,23.08
PACK- on Top Layer: 105.57,61.04 105.57,39.68 56.75,39.68 56.75,61.04
PACK- on Top Layer: 82.65,0 82.65,8.97 85.49,11.8 89.34,11.8 90.59,13.05 92.37,13.05 93.12,13.8 93.12,23.4 92.66,23.85 73.54,23.85 72.19,22.5 72.19,0.25 72.43,0
PACK- on Top Layer: 76.19,45.18 86.19,45.18 86.19,40.18 76.19,40.18
PACK- on Bottom Layer: 105.57,61.04 105.57,39.68 56.75,39.68 56.75,61.04
PACK- on Bottom Layer: 82.65,0 82.65,8.97 85.49,11.8 89.34,11.8 90.59,13.05 92.37,13.05 93.12,13.8 93.12,23.4 92.66,23.85 73.54,23.85 72.19,22.5 72.19,0.25 72.43,0
PACK- on Bottom Layer: 76.19,45.18 86.19,45.18 86.19,40.18 76.19,40.18
PACK+ on Top Layer: 113.49,62.48 51.29,62.48 51.29,81.58 53.69,87.38 59.49,89.78 107.59,89.78 111.62,88.11 113.29,84.08 113.43,84.02 113.49,83.88
PACK+ on Bottom Layer: 113.49,62.48 51.29,62.48 51.29,81.58 53.69,87.38 59.49,89.78 107.59,89.78 111.62,88.11 113.29,84.08 113.43,84.02 113.49,83.88

## Text on the board
Top Silkscreen Layer: 白灯1 | 白灯2 | RGB1 | RGB2 | RGB3 | IIC | UART | 12V
